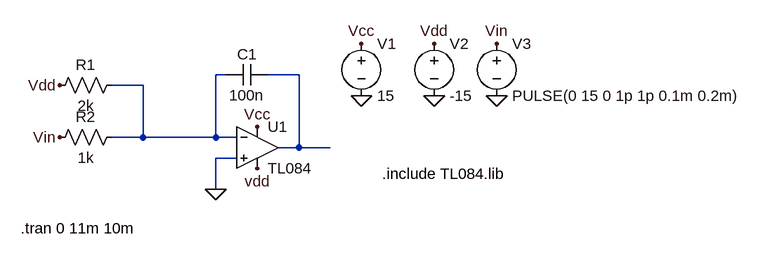
[diagram p0: schematic Draft3.asc]
Draft3.asc, the LTspice schematic file:
Version 4
SHEET 1 924 680
WIRE 112 32 96 32
WIRE 224 32 176 32
WIRE -16 48 -64 48
WIRE -16 128 -16 48
WIRE -16 128 -64 128
WIRE 96 128 96 32
WIRE 96 128 -16 128
WIRE 128 128 96 128
WIRE 224 144 224 32
WIRE 224 144 192 144
WIRE 272 144 224 144
WIRE 128 160 96 160
WIRE 96 208 96 160
FLAG 320 64 0
FLAG 432 64 0
FLAG 528 64 0
FLAG 96 208 0
FLAG 320 -16 Vcc
FLAG 160 112 Vcc
FLAG 432 -16 Vdd
FLAG -144 48 Vdd
FLAG 528 -16 Vin
FLAG -144 128 Vin
FLAG 160 176 vdd
SYMBOL Opamps\\opamp2 160 80 R0
SYMATTR InstName U1
SYMATTR Value TL084
SYMBOL res -48 32 R90
WINDOW 0 0 56 VBottom 2
WINDOW 3 32 56 VTop 2
SYMATTR InstName R1
SYMATTR Value 2k
SYMBOL res -48 112 R90
WINDOW 0 0 56 VBottom 2
WINDOW 3 32 56 VTop 2
SYMATTR InstName R2
SYMATTR Value 1k
SYMBOL cap 176 16 R90
WINDOW 0 0 32 VBottom 2
WINDOW 3 32 32 VTop 2
SYMATTR InstName C1
SYMATTR Value 100n
SYMBOL voltage 320 -32 R0
WINDOW 123 0 0 Left 0
WINDOW 39 0 0 Left 0
SYMATTR InstName V1
SYMATTR Value 15
SYMBOL voltage 432 -32 R0
WINDOW 123 0 0 Left 0
WINDOW 39 0 0 Left 0
SYMATTR InstName V2
SYMATTR Value -15
SYMBOL voltage 528 -32 R0
WINDOW 123 0 0 Left 0
WINDOW 39 0 0 Left 0
SYMATTR InstName V3
SYMATTR Value PULSE(0 15 0 1p 1p 0.1m 0.2m)
TEXT 352 184 Left 2 !.include TL084.lib
TEXT -204 268 Left 2 !.tran 0 11m 10m

The netlist it stands for:
* Draft3.asc
XU1 0 N001 Vcc Vdd N002 TL084  ; pins In+ In- V+ V- OUT
R1 N001 Vdd 2k
R2 N001 Vin 1k
C1 N002 N001 100n
V1 Vcc 0 15
V2 Vdd 0 -15
V3 Vin 0 PULSE(0 15 0 1p 1p 0.1m 0.2m)
.include TL084.lib
.tran 0 11m 10m
.backanno
.end